# EAGLE design 3x3 Matrix (EAGLE 6.5.0)
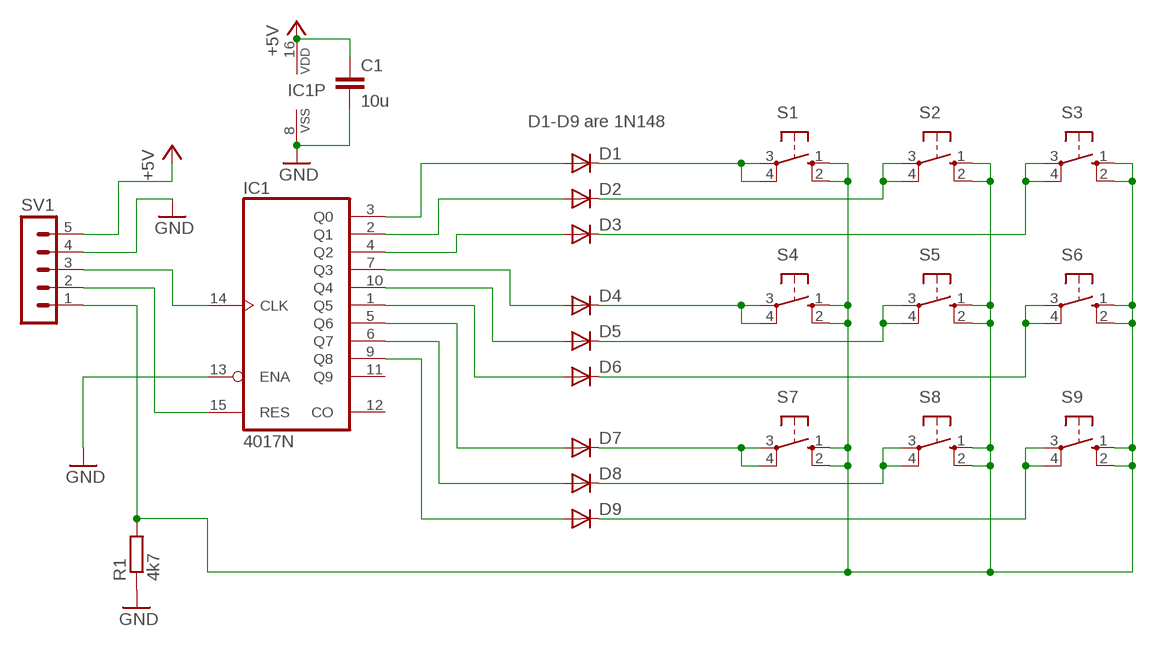
[diagram p0: schematic, sheet 1]

## Parts
C1  10u  C-EU025-024X044  [C025-024X044]
D1  1N4148DO35-7  [DO35-7]
D2  1N4148DO35-7  [DO35-7]
D3  1N4148DO35-7  [DO35-7]
D4  1N4148DO35-7  [DO35-7]
D5  1N4148DO35-7  [DO35-7]
D6  1N4148DO35-7  [DO35-7]
D7  1N4148DO35-7  [DO35-7]
D8  1N4148DO35-7  [DO35-7]
D9  1N4148DO35-7  [DO35-7]
IC1  4017N  [DIL16]
R1  4k7  R-EU_0207/10  [0207/10]
S1  10-XX  [B3F-10XX]
S2  10-XX  [B3F-10XX]
S3  10-XX  [B3F-10XX]
S4  10-XX  [B3F-10XX]
S5  10-XX  [B3F-10XX]
S6  10-XX  [B3F-10XX]
S7  10-XX  [B3F-10XX]
S8  10-XX  [B3F-10XX]
S9  10-XX  [B3F-10XX]
SV1  MA05-1  [MA05-1]

## Nets
+5V: C1.1 IC1.16(VDD) SV1.5
GND: C1.2 IC1.8(VSS) IC1.13(ENA) R1.1 SV1.4
N$1: D1.A IC1.3(Q0)
N$2: D2.A IC1.2(Q1)
N$3: D3.A IC1.4(Q2)
N$4: D9.A IC1.9(Q8)
N$5: D8.A IC1.6(Q7)
N$6: D7.A IC1.5(Q6)
N$7: D6.A IC1.1(Q5)
N$8: D5.A IC1.10(Q4)
N$9: D4.A IC1.7(Q3)
N$10: IC1.15(RES) SV1.2
N$11: D1.C S1.3(P) S1.4(P1)
N$12: D2.C S2.3(P) S2.4(P1)
N$13: R1.2 S1.1(S) S1.2(S1) S2.1(S) S2.2(S1) S3.1(S) S3.2(S1) S4.1(S) S4.2(S1) S5.1(S) S5.2(S1) S6.1(S) S6.2(S1) S7.1(S) S7.2(S1) S8.1(S) S8.2(S1) S9.1(S) S9.2(S1) SV1.1
N$14: D3.C S3.3(P) S3.4(P1)
N$15: D4.C S4.3(P) S4.4(P1)
N$16: D5.C S5.3(P) S5.4(P1)
N$17: D6.C S6.3(P) S6.4(P1)
N$18: D7.C S7.3(P) S7.4(P1)
N$19: D8.C S8.3(P) S8.4(P1)
N$20: D9.C S9.3(P) S9.4(P1)
N$21: IC1.14(CLK) SV1.3
Unconnected: IC1.11(Q9) IC1.12(CO)

## Notes on the sheet
- D1-D9 are 1N148

## Library data of the parts
C1 = rcl:C-EU: CAPACITOR, European symbol
D1-D9 = diode:1N4148: DIODE high speed (Philips)
IC1 = 40xx:4017: COUNTER/DIVIDER
R1 = rcl:R-EU_: RESISTOR, European symbol
S1-S9 = switch-omron:10-XX: OMRON SWITCH; MPN: B3F-1000; OC_FARNELL: 176432; OC_NEWARK: 36M3542
SV1 = con-lstb:MA05-1: PIN HEADER; OC_FARNELL: unknown; OC_NEWARK: unknown

## Board
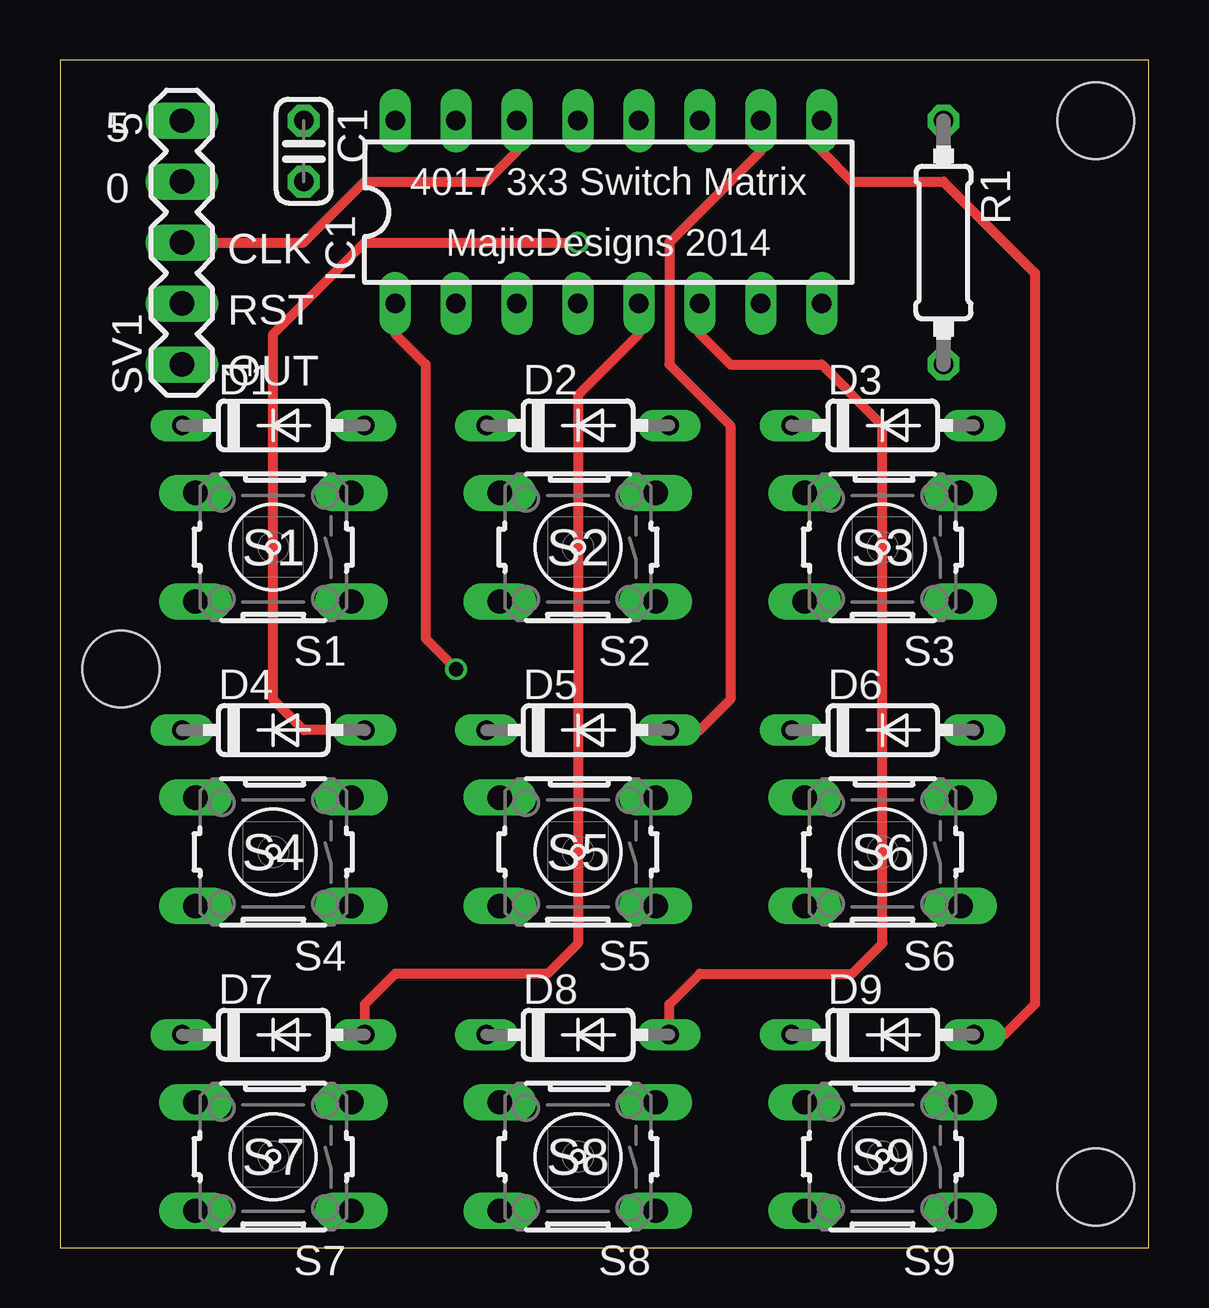
[diagram p1: board, top side]
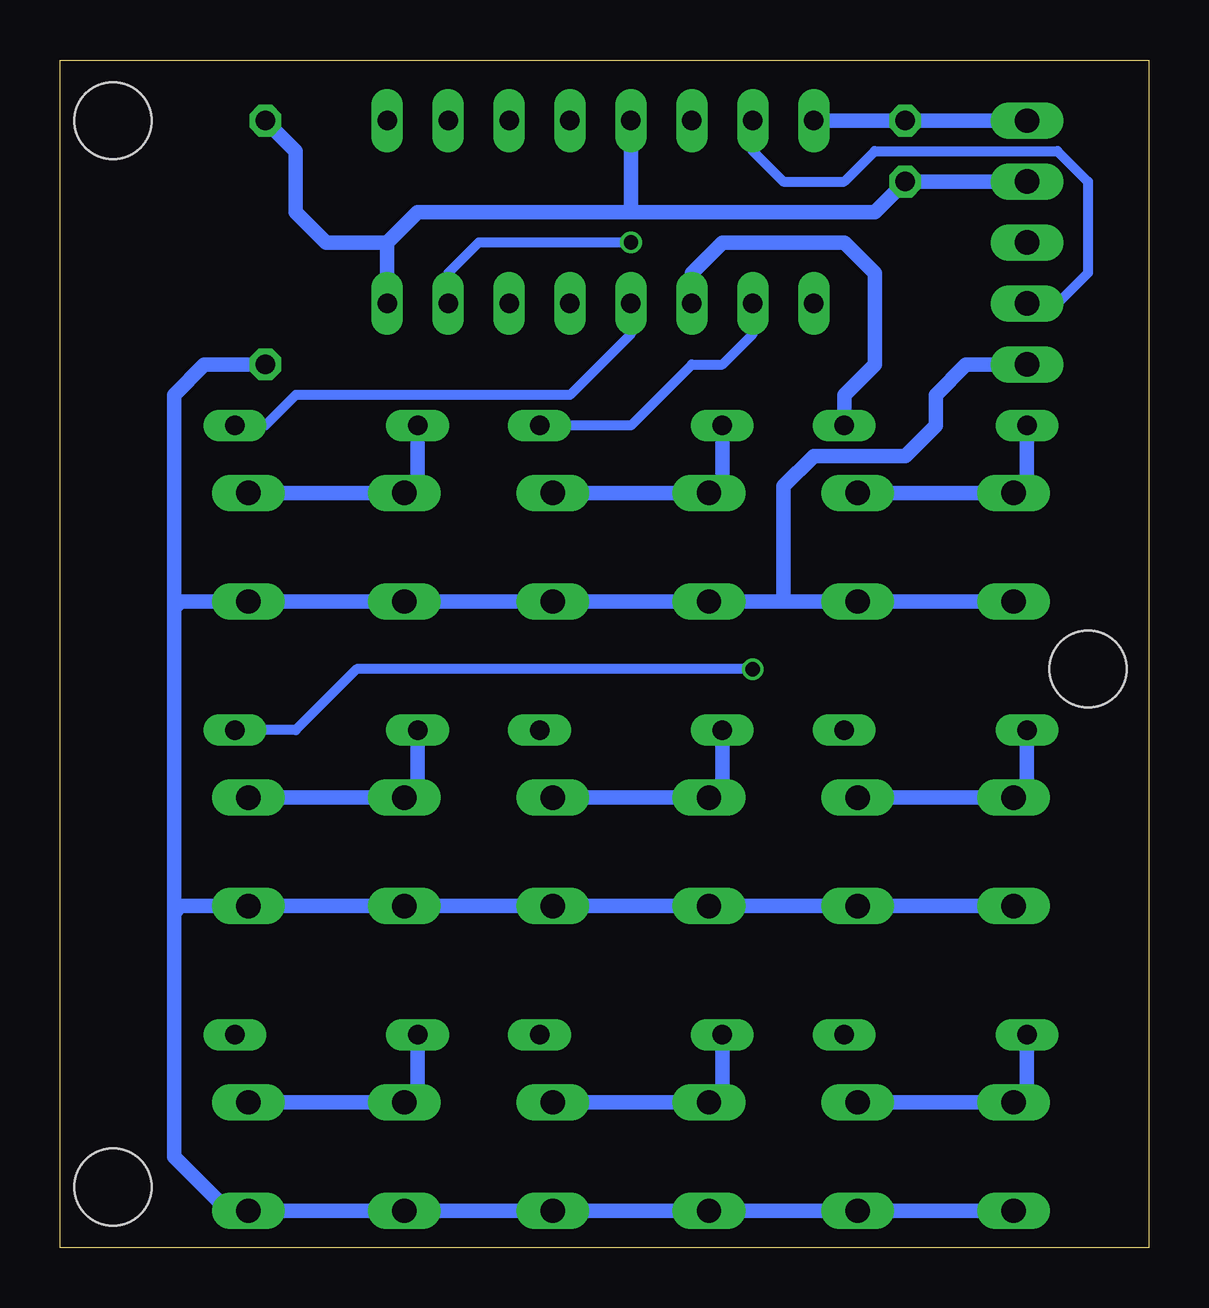
[diagram p2: board, bottom side, seen from below]

Size 45.39 x 49.52 mm. Coordinates in mm from the lower left corner, seen from the top.
Outline: 0,0 45.39,0 45.39,49.52 0,49.52 0,0
Copper layers (1*16): Top 0.035mm / dielectric 1.5mm / Bottom 0.035mm
Design rules "SeeedStudio_2layer_DRU_no_angle_20140221": minimum track width 6mil, minimum drill 12mil, track to track 6mil, track to pad 6mil, pad to pad 6mil, via to via 6mil, smd to smd 0mil, copper to edge 10mil, drill to drill 10mil, minimum pad ring 10mil, minimum via ring 6mil, stop-mask expansion 2mil, vias tented up to drill 100mil, thermal gap 10mil
Holes 3.2 mm at 2.54,24.13 43.18,46.99 43.18,2.54
Milling: 4 lines

### Footprints (pad centres in the part's own frame; a part is rotated, then mirrored left to right if it is on the bottom)
C025-024X044 = drill 0.813 octagon: 1 -1.27,0; 2 1.27,0
DO35-7 = drill 0.813 long: A 3.81,0; C -3.81,0
DIL16 = drill 0.813 long: 1 -8.89,-3.81; 2 -6.35,-3.81; 3 -3.81,-3.81; 4 -1.27,-3.81; 5 1.27,-3.81; 6 3.81,-3.81; 7 6.35,-3.81; 8 8.89,-3.81; 9 8.89,3.81; 10 6.35,3.81; 11 3.81,3.81; 12 1.27,3.81; 13 -1.27,3.81; 14 -3.81,3.81; 15 -6.35,3.81; 16 -8.89,3.81
0207/10 = drill 0.813 octagon: 1 -5.08,0; 2 5.08,0
B3F-10XX = drill 1.016 long: 1 -3.251,2.261; 2 3.251,2.261; 3 -3.251,-2.261; 4 3.251,-2.261
MA05-1 = drill 1.016 long: 1 -5.08,0; 2 -2.54,0; 3 0,0; 4 2.54,0; 5 5.08,0

### Placement (x,y rotation side)
C1  10.16,45.72 270 top
D1  8.89,34.29 0 top
D2  21.59,34.29 0 top
D3  34.29,34.29 0 top
D4  8.89,21.59 0 top
D5  21.59,21.59 0 top
D6  34.29,21.59 0 top
D7  8.89,8.89 0 top
D8  21.59,8.89 0 top
D9  34.29,8.89 0 top
IC1  22.86,43.18 0 top
R1  36.83,41.91 270 top
S1  8.89,29.21 180 top
S2  21.59,29.21 180 top
S3  34.29,29.21 180 top
S4  8.89,16.51 180 top
S5  21.59,16.51 180 top
S6  34.29,16.51 180 top
S7  8.89,3.81 180 top
S8  21.59,3.81 180 top
S9  34.29,3.81 180 top
SV1  5.08,41.91 90 top

### Tracks (layer width: path | path; a pad name or v marks a point on that pad's centre or on a via)
+5V
  Bottom 0.61: SV1.5 C1.1 IC1.16
GND
  Bottom 0.61: SV1.4 C1.2 11.43,43.18 21.59,43.18 | 21.59,43.18 30.48,43.18 31.75,41.91 | 31.75,41.91 IC1.8 | 31.75,41.91 34.29,41.91 35.56,43.18 35.56,45.72 R1.1 | IC1.13 21.59,43.18
N$1
  Bottom 0.61: IC1.3 19.05,40.64 17.78,41.91 12.7,41.91 11.43,40.64 11.43,36.83 12.7,35.56 D1.A
N$2
  Bottom 0.406: IC1.2 16.51,38.1 17.78,36.83 19.05,36.83 21.59,34.29 D2.A
N$3
  Bottom 0.406: IC1.4 21.59,38.1 24.13,35.56 35.56,35.56 36.83,34.29 D3.A
N$4
  Top 0.406: D9.A 39.37,8.89 40.64,10.16 40.64,40.64 36.83,44.45 33.02,44.45 31.75,45.72 IC1.9
N$5
  Top 0.406: D8.A 25.4,10.16 26.67,11.43 33.02,11.43 34.29,12.7 34.29,34.29 31.75,36.83 27.94,36.83 26.67,38.1 IC1.6
N$6
  Top 0.406: D7.A 12.7,10.16 13.97,11.43 20.32,11.43 21.59,12.7 21.59,35.56 24.13,38.1 IC1.5
N$7  (via drill 0.6)
  Top 0.406: IC1.1 13.97,38.1 15.24,36.83 15.24,25.4 v16.51,24.13
  Bottom 0.406: v16.51,24.13 33.02,24.13 35.56,21.59 D6.A
N$8
  Top 0.406: IC1.10 29.21,45.72 25.4,41.91 25.4,36.83 27.94,34.29 27.94,22.86 26.67,21.59 D5.A
N$9  (via drill 0.6)
  Top 0.406: D4.A 10.16,21.59 8.89,22.86 8.89,38.1 12.7,41.91 v21.59,41.91
  Bottom 0.406: v21.59,41.91 27.94,41.91 29.21,40.64 IC1.7
N$10
  Bottom 0.406: IC1.15 16.51,45.72 15.24,44.45 12.7,44.45 11.43,45.72 3.81,45.72 2.54,44.45 2.54,40.64 3.81,39.37 SV1.2
N$11
  Bottom 0.61: D1.C 5.08,32.03 S1.4 S1.3
N$12
  Bottom 0.61: D2.C 17.78,32.03 S2.4 S2.3
N$13
  Bottom 0.61: S7.2 S7.1 S8.2 S8.1 S9.2 | S9.2 S9.1 | S4.2 S4.1 S5.2 S5.1 S6.2 S6.1 40.36,14.25 40.64,13.97 | S9.2 38.38,1.55 40.64,3.81 40.64,13.97 | 40.64,13.97 40.64,26.67 | 40.64,26.67 40.64,35.56 39.37,36.83 R1.2 | 40.64,26.67 40.36,26.95 S3.1 S3.2 S2.1 S2.2 15.24,26.95 | S1.2 S1.1 15.24,26.95 | SV1.1 7.62,36.83 8.89,35.56 8.89,34.29 10.16,33.02 13.97,33.02 15.24,31.75 15.24,26.95
N$14
  Bottom 0.61: D3.C 30.48,32.03 S3.4 S3.3
N$15
  Bottom 0.61: D4.C 5.08,19.33 S4.4 S4.3
N$16
  Bottom 0.61: D5.C 17.78,19.33 S5.4 S5.3
N$17
  Bottom 0.61: D6.C 30.48,19.33 S6.4 S6.3
N$18
  Bottom 0.61: D7.C 5.08,6.63 S7.4 S7.3
N$19
  Bottom 0.61: D8.C 17.78,6.63 S8.4 S8.3
N$20
  Bottom 0.61: S9.3 S9.4 30.48,6.63 D9.C
N$21
  Top 0.406: IC1.14 19.05,45.72 17.78,44.45 12.7,44.45 10.16,41.91 SV1.3

### Text on the board
_tplace: 5 | 4017 3x3 Switch Matrix | 0 | MajicDesigns 2014 | CLK | RST | OUT | S1 | S2 | S3 | S4 | S5 | S6 | S7 | S8 | S9